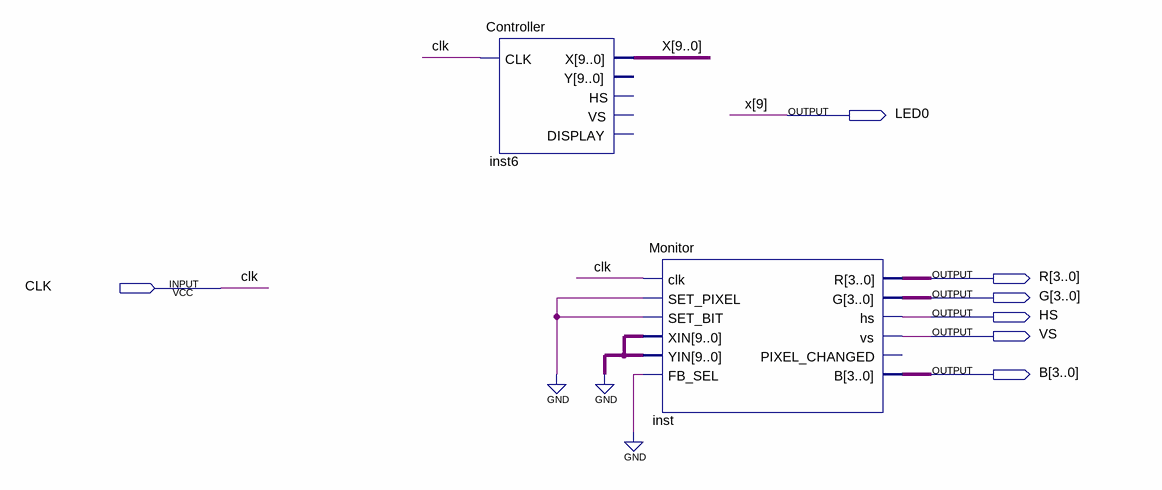
[diagram p0: schematic sheet]
// Quartus schematic VgaTest.bdf as structural Verilog: 2 symbols, 7 pins
module VgaTest (
  input  CLK,
  output LED0,
  output [3:0] R,
  output [3:0] G,
  output HS,
  output VS,
  output [3:0] B
);

  wire [8:0] x;

  Controller inst6 (.CLK(CLK), .X({LED0, x}));  // open: Y, HS, VS, DISPLAY
  Monitor inst (
    .clk(CLK), .SET_PIXEL(1'b0), .SET_BIT(1'b0), .XIN({10{1'b0}}), .YIN({10{1'b0}}), .FB_SEL(1'b0), .R(R),
    .G(G), .hs(HS), .vs(VS), .B(B));  // open: PIXEL_CHANGED

  // Other names for the same wires on the sheet: x[9] = LED0
endmodule
